# Altium schematic sheet voeding.SchDoc
size A4; SheetNumber: 4; SheetTotal: 4
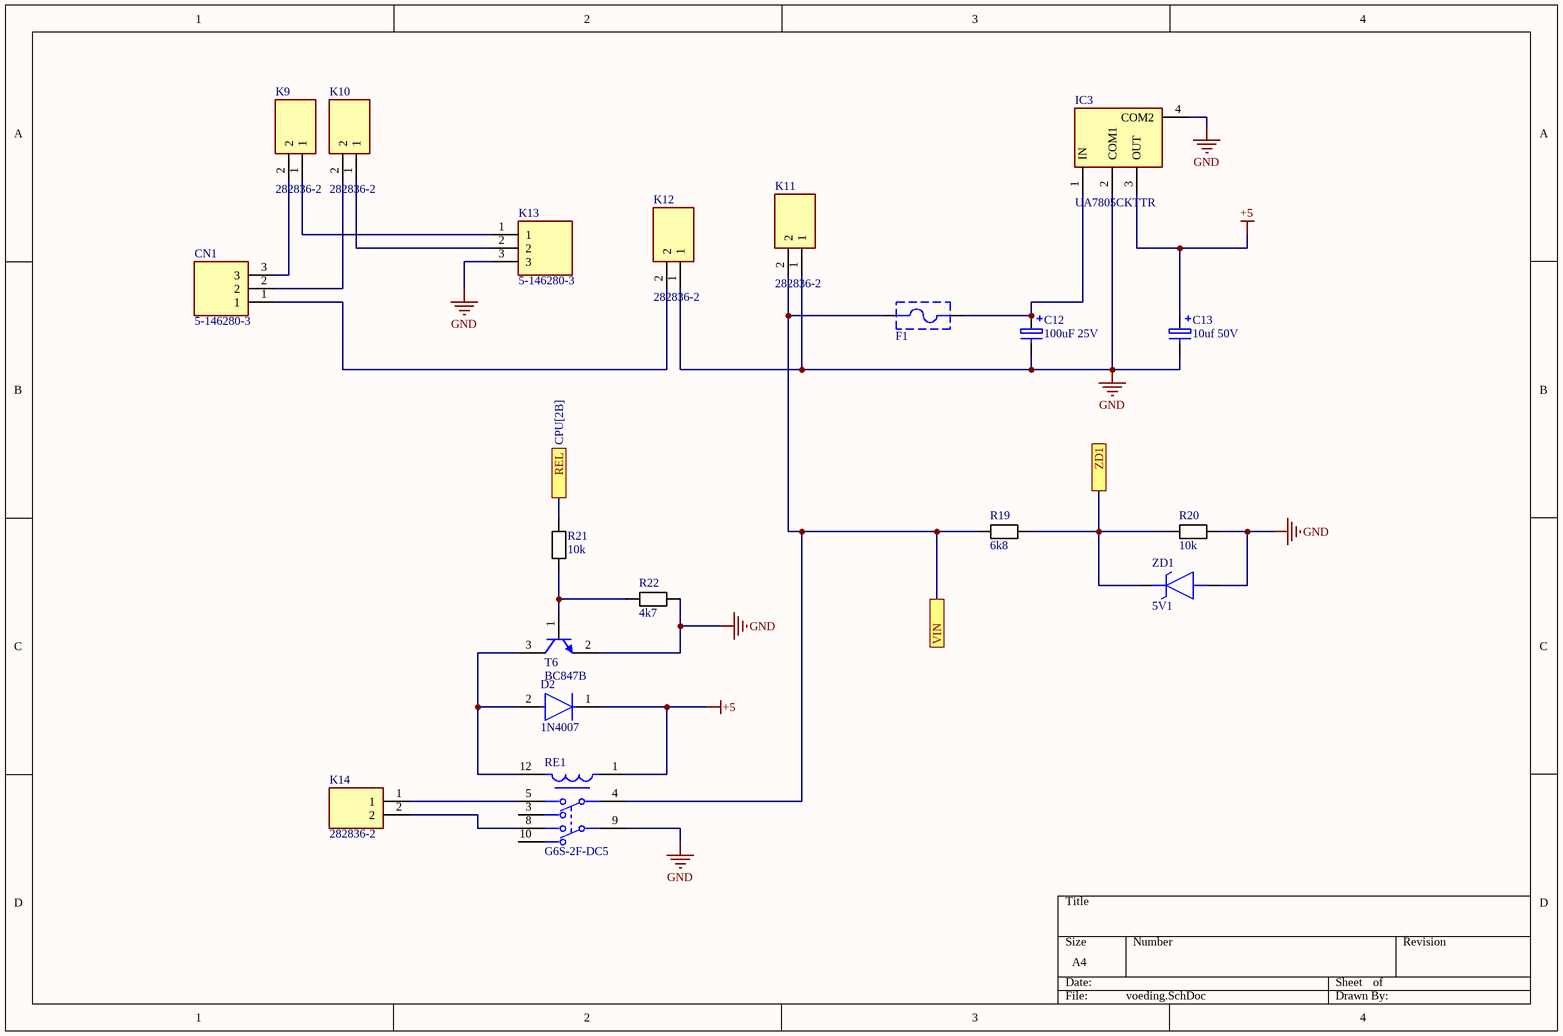
[diagram p0: voeding.SchDoc]

## Parts
C12  100uF 25V  [Elco 100uF 25V]
C13  10uf 50V  [Elco 10uF 50V]
CN1  5-146280-3  [3 Pin Header]
D2  1N4007  [1N4007]
F1  696101000002  [zekeringhouder]  (value not drawn)
IC3  UA7805CKTTR  [FP-KTT0003A-MFG]
K9  282836-2  [Schroefconnector 2 Pin]
K10  282836-2  [Schroefconnector 2 Pin]
K11  282836-2  [Schroefconnector 2 Pin]
K12  282836-2  [Schroefconnector 2 Pin]
K13  5-146280-3  [3 Pin Header]
K14  282836-2  [Schroefconnector 2 Pin]
R19  6k8  [registor]
R20  10k  [registor]
R21  10k  [registor]
R22  4k7  [registor]
RE1  G6S-2F-DC5  [FP-G6S-2F-DC5-MFG]
T6  BC847B  [INF-SOT23_L]
ZD1  5V1  [SOD3716X135N]

## Ports
REL (see CPU[2B]), VIN (see soldeer[2A]), ZD1 (see CPU[3B])

## Nets
+5: C13.1 D2.1(C) IC3.3(OUT) RE1.1
GND: C12.2 C13.2 IC3.2(COM1) IC3.4(COM2) K11.1 K12.1 K13.3 R20.2 R22.2 RE1.9 T6.2(E) ZD1.2(A)
REL: R21.2 ; port REL
VIN: F1.1 K11.2 R19.1 RE1.4 ; port VIN
ZD1: R19.2 R20.1 ZD1.1(K) ; port ZD1
NetC12_1: C12.1 F1.2 IC3.1(IN)
NetCN1_1: CN1.1 K12.2
NetCN1_2: CN1.2 K10.2
NetCN1_3: CN1.3 K9.2
NetD2_2: D2.2(A) RE1.12 T6.3(C)
NetK9_1: K9.1 K13.1
NetK10_1: K10.1 K13.2
NetK14_1: K14.1 RE1.5
NetK14_2: K14.2 RE1.8
NetR21_1: R21.1 R22.1 T6.1(B)

Not connected (* = marked no-connect by the designer): RE1 3 10

## Library data of the parts
C12 = Condensator 100uF 25V: Part Number: 02015A270JAT2A; Manufacturer: AVX Interconnect / Elco
C13 = Condensator 10uf 50V: Part Number: 02015A270JAT2A; Manufacturer: AVX Interconnect / Elco
CN1 = 3 Pin Header: Connector 5-146280-3; Manufacturer_Name: TE Connectivity; Datasheet Link: https://componentsearchengine.com//5-146280-3.pdf; Height: 8.21mm; Mouser2 Part Number: 571-5-146280-3; Mouser2 Price/Stock: https://www.mouser.com/Search/Refine.aspx?Keyword=571-5-146280-3; Manufacturer_Part_Number: 5-146280-3
D2 = 1N4007: Rectifier diode 1000 V 1 A DO-41, ,; Manufacturer: Diotec; Max Surge Forward Current: 27A; Forward Current: 1A; Max Junction Temp: +175°C; Reverse Voltage: 1000V; Value: 15pF; Peak Reverse Current: 5uA; Category: Diode; Temperature Range Low: -50°C; Automotive: No; Temperature: -50°C to +175°C; Lead Free: Yes; ComponentLink2Description: Datasheet; Max Repetitive Reverse Voltage: 1000V; ComponentLink2URL: https://datasheet.octopart.com/1N4007-Diotec-datasheet-62346875.pdf; Manufacturer Part Number: 1N4007; Device Class L3: Rectifier Diodes; Height: 2.8mm; Octopart: https://octopart.com/1n4007-diotec-4040411; Package: 1N4007; Temperature Range High: +175°C; Device Class L1: Discrete Semiconductors; Device Class L2: Diodes; RoHS: TRUE; Capacitance: 15pF; Ipc Land Pattern Name: DIOAD888W100L520D280
F1 = zekeringhouder: WR-FSH Fuseholder THT Blocks PCB Clip Cover; Manufacturer: Wurth Elektronik; Fuse Size: 5x20mm; ComponentLink1Description: Website Link; ComponentLink1URL: https://www.we-online.com/redexpert/article/696101000002?ad; ComponentLink2Description: Datasheet Link; ComponentLink2URL: https://www.we-online.com/redexpert/spec/696101000002?ad; Manufacturer Part Number: 696101000002; Category: Fuse Holder; Match Code: WR-FSH; Mount: THT; Operating Temperature Max: 120°C; Operating Temperature Min: -30°C; Packaging: Box
IC3 = IC4: IC REG LIN 5V 1.5A DDPAK/TO263-3; Output Type: Fixed; Quiescent Current: 8mA; Dropout Voltage: 2V; Max Input Voltage: 25V; Number of Regulators: 1; Max Output Voltage: 5.2V; Polarity: Positive; Min Output Voltage: 4.8V; Power Supply Rejection Ratio (PSRR): 78dB; Min Input Voltage: 7V; Power Rating: 15W; Number of Pins: 3; Output Voltage: 5V; Max Output Current: 1.5A; Nominal Output Voltage: 5V; Case/Package: TO-263; Width: 9.65mm; REACH SVHC: No SVHC; Max Operating Temperature: 125°C; Output Current: 1.5A; Weight: 0.050897oz; Contact Plating: Tin; Packaging: Tape and Reel; Mount: Surface Mount; Radiation Hardening: No; Lead Free: Lead Free; Min Operating Temperature: 0°C; Length: 10.67mm; Package Quantity: 1; Number of Outputs: 1; Height: 4.83mm
K9-K12 K14 = Schroefconnector 2 Pin L: Connector; Manufacturer_Name: TE Connectivity; Datasheet Link: https://www.te.com/commerce/DocumentDelivery/DDEController?Action=showdoc&DocId=Customer+Drawing%7F282836%7FJ%7Fpdf%7FEnglish%7FENG_CD_282836_J.pdf%7F282836-2; Height: 10mm; Manufacturer_Part_Number: 282836-2
K13 = 3 Pin Header L: Connector 5-146280-3; Manufacturer_Name: TE Connectivity; Datasheet Link: https://componentsearchengine.com//5-146280-3.pdf; Height: 8.21mm; Mouser2 Part Number: 571-5-146280-3; Mouser2 Price/Stock: https://www.mouser.com/Search/Refine.aspx?Keyword=571-5-146280-3; Manufacturer_Part_Number: 5-146280-3
R19-R22 = resistor: Manufacturer: Vishay Dale; Part Number: CRCW08050000Z0EA
RE1 = CMP-08823-000012-1: RELAY TELECOM DPDT 2A 5VDC; Manufacturer: Omron; Coil Resistance: 178Ω; Coil Current: 28.1mA; Coil Voltage: 5V; Standoff Height: 0.35mm; Coil Power: 140mW; Coil Type: Non-Latching; Number Of Contacts: 2; RoHS: TRUE; Device Class L3: Signal Relays; Ambient Temperature Range Low: -40°C; Switching Current: 2A; Device Class L1: Electromechanical; Lead Free: Yes; Category: Relay; Digikey Description: RELAY TELECOM DPDT 2A 5VDC; Height: 9.4mm; Temperature: -40°C to +85°C; Throw Configuration: DPDT; Octopart: https://octopart.com/g6s-2f-dc5-omron-85236; Package: G6S-2F-DC5; Temperature Range High: +85°C; Automotive: No; Current Rating: 2A; Manufacturer Part Number: G6S-2F-DC5; Mouser Description: Electromechanical Relay 5VDC 178Ohm 2A DPDT (14.8x9.2x9.2)mm SMD Signal Relay; Temperature Range Low: -40°C; Device Class L2: Relays; Ambient Temperature Range High: +85°C; ComponentLink2URL: https://omronfs.omron.com/en_US/ecb/products/pdf/en-g6s.pdf; ComponentLink2Description: Datasheet
T6 = BC847B: NPN Silicon AF Transistor, 45 V VCEO, 100 mA IC, SOT23, Reel, Green; Manufacturer: Infineon; VEBO (max): 6Â V; ICBO (max): 15Â nA; VCBO (max): 50Â V; IBM (max): 200Â mA; Green: TRUE; Ptot (max): 330Â mW; fT (typ): 250Â MHz; IC (max): 100Â mA; VCEO (max): 45Â V; PackageDescription: 3-Pin Small Outline Transistor Package, 1.3 x 2.9 mm Body, 0.95 mm Pitch; ComponentLink3URL: http://www.infineon.com/dgdl/SOT23-Package_Overview.pdf?folderId=db3a30431936bc4b0119532290053c66&fileId=db3a30431936bc4b0119533468123c85; PackageVersion: Apr-08; Packing: Reel; ComponentLink3Description: Package Specification; ComponentLink2URL: http://www.infineon.com/dgdl/bc847series_bc848series_bc849series_bc850series.pdf?folderId=db3a304314dca389011541d30fa21656&fileId=db3a304314dca389011541d4630a1657; ComponentLink1URL: http://www.infineon.com/; ComponentLink2Description: Datasheet; Polarity: NPN; Mounting Technology: Surface Mount; PackageReference: SOT23; ICM (max): 200Â mA; ComponentLink1Description: Manufacturer URL; PartNumber: BC847B
ZD1 = MMSZ4689T1G: Zener Diode; Manufacturer_Name: ON Semiconductor; Datasheet Link: http://www.onsemi.com/pub/Collateral/MMSZ4678T1-D.PDF; Height: 1.35mm; Manufacturer_Part_Number: MMSZ4689T1G; Mouser Part Number: 863-MMSZ4689T1G; Mouser Price/Stock: https://www.mouser.co.uk/ProductDetail/ON-Semiconductor/MMSZ4689T1G/?qs=P4IOph%252Bbot%252Blaz%2FZtdyBaA%3D%3D; Arrow Part Number: MMSZ4689T1G; Arrow Price/Stock: https://www.arrow.com/en/products/mmsz4689t1g/on-semiconductor